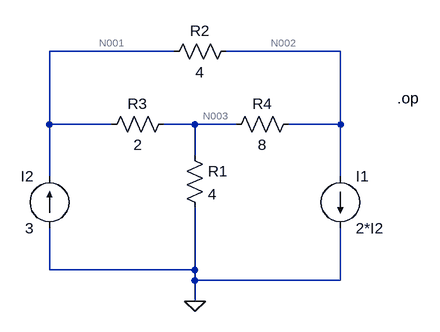
[diagram p0: schematic Ejemplo.asc]
Ejemplo.asc, the LTspice schematic file:
Version 4
SHEET 1 880 680
WIRE 176 -16 -16 -16
WIRE 432 -16 256 -16
WIRE -16 96 -16 -16
WIRE 80 96 -16 96
WIRE 208 96 160 96
WIRE 272 96 208 96
WIRE 432 96 432 -16
WIRE 432 96 352 96
WIRE 208 144 208 96
WIRE -16 176 -16 96
WIRE 432 176 432 96
WIRE -16 320 -16 256
WIRE 208 320 208 224
WIRE 208 320 -16 320
WIRE 208 336 208 320
WIRE 432 336 432 256
WIRE 432 336 208 336
WIRE 208 368 208 336
FLAG 208 368 0
SYMBOL res 192 128 R0
SYMATTR InstName R1
SYMATTR Value 4
SYMBOL res 272 -32 R90
WINDOW 0 0 56 VBottom 2
WINDOW 3 32 56 VTop 2
SYMATTR InstName R2
SYMATTR Value 4
SYMBOL res 176 80 R90
WINDOW 0 0 56 VBottom 2
WINDOW 3 32 56 VTop 2
SYMATTR InstName R3
SYMATTR Value 2
SYMBOL res 368 80 R90
WINDOW 0 0 56 VBottom 2
WINDOW 3 32 56 VTop 2
SYMATTR InstName R4
SYMATTR Value 8
SYMBOL current 432 176 R0
SYMATTR InstName I1
SYMATTR Value 2*I2
SYMBOL current -16 256 R180
WINDOW 0 24 80 Left 2
WINDOW 3 24 0 Left 2
SYMATTR InstName I2
SYMATTR Value 3
TEXT 520 56 Left 2 !.op

The netlist it stands for:
* Ejemplo.asc
R1 N003 0 4
R2 N002 N001 4
R3 N003 N001 2
R4 N002 N003 8
I1 N002 0 2*I2
I2 0 N001 3
.op
.backanno
.end

* Results of the author's LTspice run, read from the files saved beside the schematic
* Operating Point:
*   V(n003) = 4 V
*   V(n002) = 571.4 mV
*   V(n001) = 6.857 V
*   I(I1) = 2 A
*   I(I2) = 3 A
*   I(R1) = 1 A
*   I(R2) = -1.571 A
*   I(R3) = -1.429 A
*   I(R4) = -428.6 mA